# Altium schematic sheet 5-PWR_ADC.SCHDOC
size A4
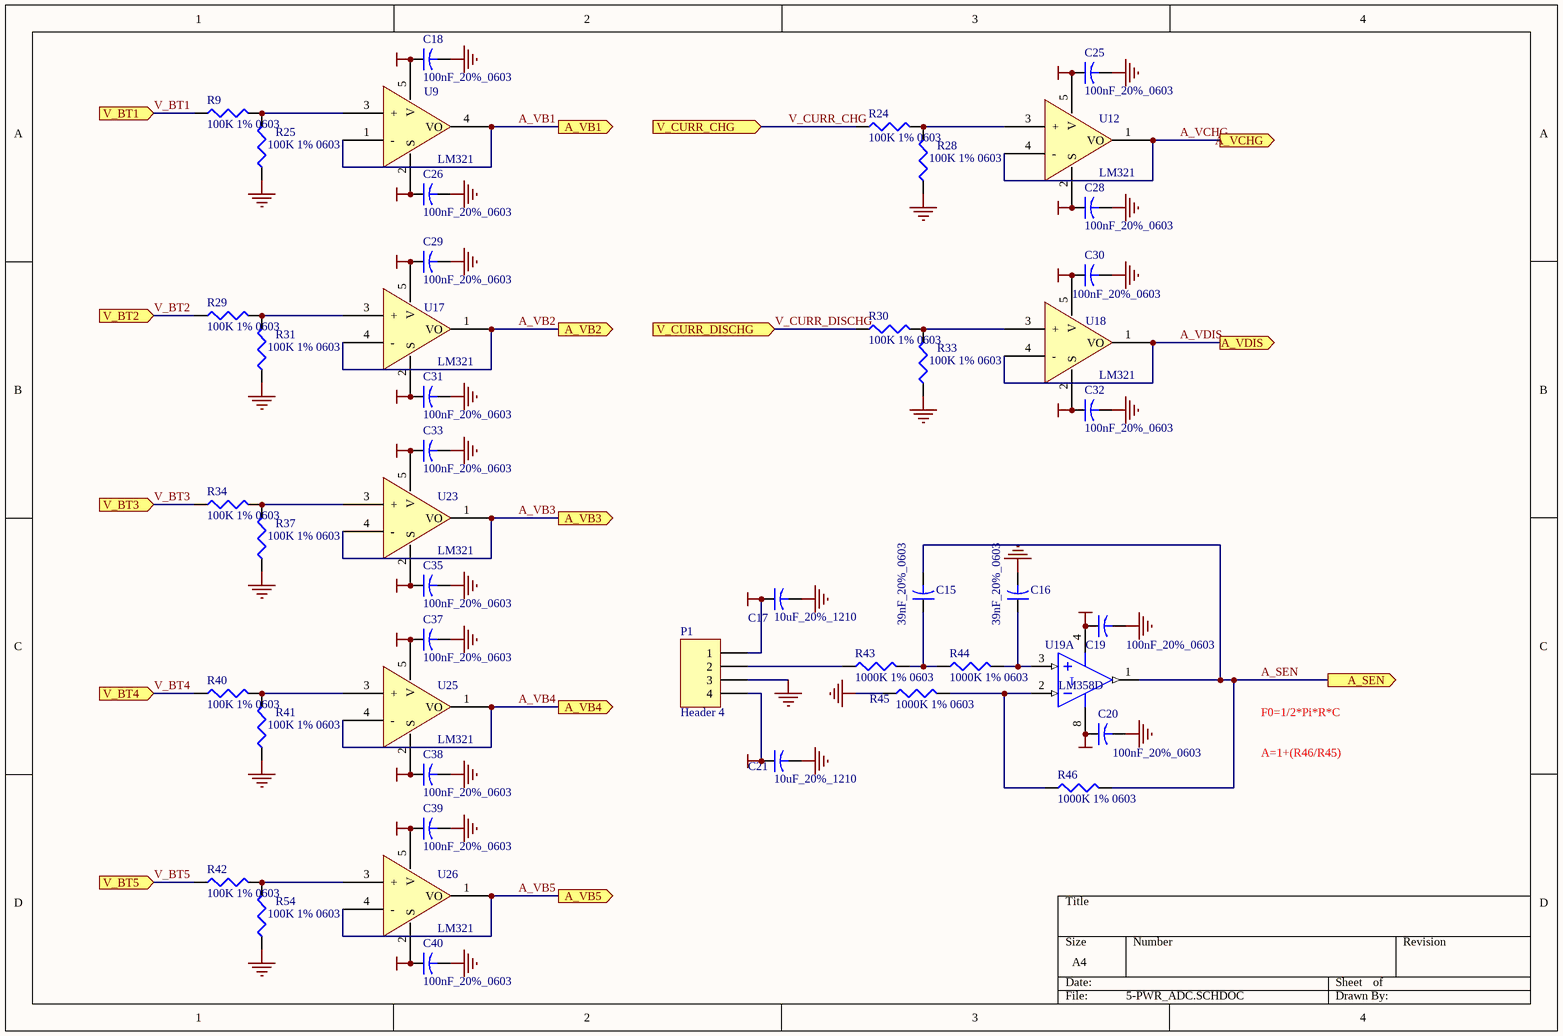
[diagram p0: 5-PWR_ADC.SCHDOC]

## Parts
C15  39nF_20%_0603  [C1608-0603]
C16  39nF_20%_0603  [C1608-0603]
C17  10uF_20%_1210  [CC3216-1206]
C18  100nF_20%_0603  [C1608-0603]
C19  100nF_20%_0603  [C1608-0603]
C20  100nF_20%_0603  [C1608-0603]
C21  10uF_20%_1210  [CC3216-1206]
C25  100nF_20%_0603  [C1608-0603]
C26  100nF_20%_0603  [C1608-0603]
C28  100nF_20%_0603  [C1608-0603]
C29  100nF_20%_0603  [C1608-0603]
C30  100nF_20%_0603  [C1608-0603]
C31  100nF_20%_0603  [C1608-0603]
C32  100nF_20%_0603  [C1608-0603]
C33  100nF_20%_0603  [C1608-0603]
C35  100nF_20%_0603  [C1608-0603]
C37  100nF_20%_0603  [C1608-0603]
C38  100nF_20%_0603  [C1608-0603]
C39  100nF_20%_0603  [C1608-0603]
C40  100nF_20%_0603  [C1608-0603]
P1  Header 4  [XH-04H]
R9  value 100K 1% 0603  [C1608-0603]  (hidden comment: 1K_5%_0603)
R24  value 100K 1% 0603  [C1608-0603]  (hidden comment: 1K_5%_0603)
R25  value 100K 1% 0603  [C1608-0603]  (hidden comment: 1K_5%_0603)
R28  value 100K 1% 0603  [C1608-0603]  (hidden comment: 1K_5%_0603)
R29  value 100K 1% 0603  [C1608-0603]  (hidden comment: 1K_5%_0603)
R30  value 100K 1% 0603  [C1608-0603]  (hidden comment: 1K_5%_0603)
R31  value 100K 1% 0603  [C1608-0603]  (hidden comment: 1K_5%_0603)
R33  value 100K 1% 0603  [C1608-0603]  (hidden comment: 1K_5%_0603)
R34  value 100K 1% 0603  [C1608-0603]  (hidden comment: 1K_5%_0603)
R37  value 100K 1% 0603  [C1608-0603]  (hidden comment: 1K_5%_0603)
R40  value 100K 1% 0603  [C1608-0603]  (hidden comment: 1K_5%_0603)
R41  value 100K 1% 0603  [C1608-0603]  (hidden comment: 1K_5%_0603)
R42  value 100K 1% 0603  [C1608-0603]  (hidden comment: 1K_5%_0603)
R43  value 1000K 1% 0603  [C1608-0603]  (hidden comment: 1K_5%_0603)
R44  value 1000K 1% 0603  [C1608-0603]  (hidden comment: 1K_5%_0603)
R45  value 1000K 1% 0603  [C1608-0603]  (hidden comment: 1K_5%_0603)
R46  value 1000K 1% 0603  [C1608-0603]  (hidden comment: 1K_5%_0603)
R54  value 100K 1% 0603  [C1608-0603]  (hidden comment: 1K_5%_0603)
U9  LM321  [SOT23-5]
U12  LM321  [SOT23-5]
U17  LM321  [SOT23-5]
U18  LM321  [SOT23-5]
U19  LM358D  [751-02]  (part A of 2)
U23  LM321  [SOT23-5]
U25  LM321  [SOT23-5]
U26  LM321  [SOT23-5]

## Ports
A_SEN (out), A_VB1 (out), A_VB2 (out), A_VB3 (out), A_VB4 (out), A_VB5 (out), A_VCHG (out), A_VDIS (out), V_BT1 (in), V_BT2 (in), V_BT3 (in), V_BT4 (in), V_BT5 (in), V_CURR_CHG (in), V_CURR_DISCHG (in)

## Nets
GND: C16.2 C17.2 C18.2 C19.2 C20.2 C21.2 C25.2 C26.2 C28.2 C29.2 C30.2 C31.2 C32.2 C33.2 C35.2 C37.2 C38.2 C39.2 C40.2 P1.3 R25.1 R28.1 R31.1 R33.1 R37.1 R41.1 R45.1 R54.1
VCC_2V8: C17.1 C18.1 C20.1 C25.1 C29.1 C30.1 C33.1 C37.1 C39.1 P1.1 U9.5(V) U12.5(V) U17.5(V) U18.5(V) U19.8(V+) U23.5(V) U25.5(V) U26.5(V)
VCC_-2V8: C19.1 C21.1 C26.1 C28.1 C31.1 C32.1 C35.1 C38.1 C40.1 P1.4 U9.2(S) U12.2(S) U17.2(S) U18.2(S) U19.4(V-) U23.2(S) U25.2(S) U26.2(S)
A_SEN: C15.2 R46.2 U19.1(OUT) ; port A_SEN
A_VB1: U9.1(-) U9.4(VO) ; port A_VB1
A_VB2: U17.1(VO) U17.4(-) ; port A_VB2
A_VB3: U23.1(VO) U23.4(-) ; port A_VB3
A_VB4: U25.1(VO) U25.4(-) ; port A_VB4
A_VB5: U26.1(VO) U26.4(-) ; port A_VB5
A_VCHG: U12.1(VO) U12.4(-) ; port A_VCHG
A_VDIS: U18.1(VO) U18.4(-) ; port A_VDIS
V_BT1: R9.1 ; port V_BT1
V_BT2: R29.1 ; port V_BT2
V_BT3: R34.1 ; port V_BT3
V_BT4: R40.1 ; port V_BT4
V_BT5: R42.1 ; port V_BT5
V_CURR_CHG: R24.1 ; port V_CURR_CHG
V_CURR_DISCHG: R30.1 ; port V_CURR_DISCHG
NetC15_1: C15.1 R43.2 R44.1
NetC16_1: C16.1 R44.2 U19.3(IN+)
NetP1_2: P1.2 R43.1
NetR9_2: R9.2 R25.2 U9.3(+)
NetR24_2: R24.2 R28.2 U12.3(+)
NetR29_2: R29.2 R31.2 U17.3(+)
NetR30_2: R30.2 R33.2 U18.3(+)
NetR34_2: R34.2 R37.2 U23.3(+)
NetR40_2: R40.2 R41.2 U25.3(+)
NetR42_2: R42.2 R54.2 U26.3(+)
NetR45_2: R45.2 R46.1 U19.2(IN-)

## Notes on the sheet
- F0=1/2*Pi*R*C
- A=1+(R46/R45)

## Library data of the parts
C15-C21 C25 C26 C28-C33 C35 C37-C40 = Cap2: Capacitor; Value: 0.1uF 20% 0603; Published: 23-Sep-2002; Publisher: Altium Limited
P1 = Header 4: Header, 4-Pin; LatestRevisionDate: 17-Jul-2002; LatestRevisionNote: Re-released for DXP Platform.; Publisher: Altium Limited
R9 R24 R25 R28-R31 R33 R34 R37 R40-R46 R54 = Res3: Resistor; Published: 8-Jun-2000; Revision: July-2002: Re-released for DXP Platform.; Publisher: Altium Limited
U9 U12 U17 U18 U23 U25 U26 = MCP6141
U19 = LM358D: Dual Low-Power Operational Amplifier; Published: 17-Jul-2002; DatasheetDocument: 1988; PackageReference: 751-02; Publisher: Altium Limited; Code_JEDEC: MS-012-AA; Code_IPC: SO8